# Altium schematic sheet main.SchDoc
size A4
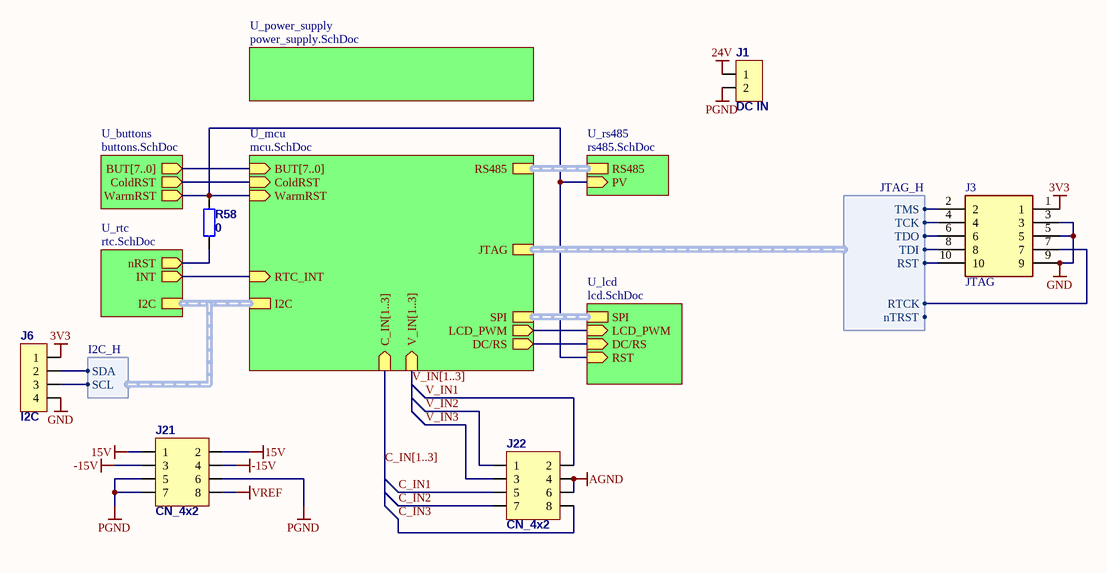
[diagram p0: main.SchDoc]

## Parts
J1  DC IN  [15EDGRC-3.81/2P_WO_CN]
J3  JTAG  [FTSH-105-XX-YYY-DV-K-P-TR]
J6  I2C  [GP_4x1]
J21  CN_4x2  [GP_4x2]
J22  CN_4x2  [GP_4x2]
R58  0  [R0603]

## Sub-sheets
U_buttons = buttons.SchDoc: BUT[7..0] (out), ColdRST (out), WarmRST (out)
U_lcd = lcd.SchDoc: SPI (harness SPI_H), LCD_PWM (in), DC/RS (in), RST (in)
U_mcu = mcu.SchDoc: BUT[7..0] (in), I2C (harness I2C_H), JTAG (harness JTAG_H), SPI (harness SPI_H), RS485 (harness RS485_H), V_IN[1..3] (in), C_IN[1..3] (in), ColdRST (in), WarmRST (in), RTC_INT (in), LCD_PWM (out), DC/RS (out)
U_power_supply = power_supply.SchDoc: no entries
U_rs485 = rs485.SchDoc: PV (in), RS485 (harness RS485_H)
U_rtc = rtc.SchDoc: nRST (out), INT (out), I2C (harness I2C_H)

## Harnesses
JTAG_H: nTRST, RST, RTCK, TCK, TDI, TDO, TMS
I2C_H: SCL, SDA

## Nets
3V3: J3.1 J6.1
15V: J21.1 J21.2
24V: J1.1
-15V: J21.3 J21.4
AGND: J22.4 J22.6
GND: J3.3 J3.5 J3.9 J6.4
PGND: J1.2 J21.5 J21.6 J21.7
VREF: J21.8
C_IN1: J22.5
C_IN2: J22.7
C_IN3: J22.8
V_IN1: J22.2
V_IN2: J22.1
V_IN3: J22.3
NetJ3_2: J3.2 ; sheet U_mcu/JTAG.TMS
NetJ3_4: J3.4 ; sheet U_mcu/JTAG.TCK
NetJ3_6: J3.6 ; sheet U_mcu/JTAG.TDO
NetJ3_7: J3.7 ; sheet U_mcu/JTAG.RTCK
NetJ3_8: J3.8 ; sheet U_mcu/JTAG.TDI
NetJ3_10: J3.10 ; sheet U_mcu/JTAG.RST
NetJ6_2: J6.2 ; sheet U_mcu/I2C.SDA
NetJ6_3: J6.3 ; sheet U_mcu/I2C.SCL
NetR58_1: R58.1 ; sheet U_rtc/nRST
NetR58_2: R58.2 ; sheet U_buttons/WarmRST, sheet U_mcu/WarmRST, sheet U_rs485/PV, sheet U_lcd/RST
(unnamed): sheet U_buttons/ColdRST, sheet U_mcu/ColdRST
(unnamed): sheet U_mcu/RTC_INT, sheet U_rtc/INT
(unnamed): sheet U_mcu/LCD_PWM, sheet U_lcd/LCD_PWM
(unnamed): sheet U_mcu/DC/RS, sheet U_lcd/DC/RS

## Buses and harness runs
bus C_IN[1..3] = sheet U_mcu/C_IN[1..3]
bus sheet U_buttons/BUT[7..0] = sheet U_mcu/BUT[7..0]
bus V_IN[1..3] = sheet U_mcu/V_IN[1..3]
harness sheet U_lcd/SPI = sheet U_mcu/SPI
harness sheet U_mcu/I2C = sheet U_rtc/I2C
harness sheet U_mcu/RS485 = sheet U_rs485/RS485

## Library data of the parts
J1 = CN_2x1
J3 = FTSH-105-01-L-DV-K-P-TR: Connector; Manufacturer_Name: SAMTEC; Datasheet Link: http://suddendocs.samtec.com/prints/ftsh-1xx-xx-xxx-dv-xxx-xxx-mkt.pdf; Manufacturer_Part_Number: FTSH-105-01-L-DV-K-P-TR
J6 = CN_4x1
R58 = Res: Resistor; Published: 19-Feb-2006; ComponentLink1Description: datasheet; ComponentLink2Description: supplier; Value: 0